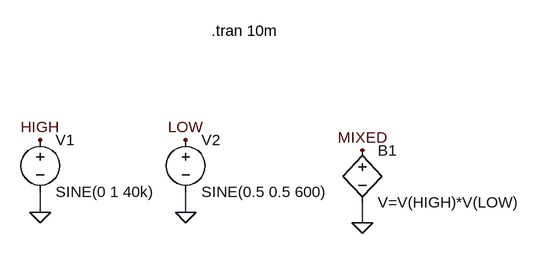
[diagram p0: schematic Draft4.asc]
Draft4.asc, the LTspice schematic file:
Version 4
SHEET 1 880 680
WIRE 0 368 0 336
WIRE 224 368 224 336
WIRE 496 384 496 352
FLAG 0 368 0
FLAG 224 368 0
FLAG 0 256 HIGH
FLAG 224 256 LOW
FLAG 496 384 0
FLAG 496 272 MIXED
SYMBOL voltage 0 240 R0
SYMATTR InstName V1
SYMATTR Value SINE(0 1 40k)
SYMBOL voltage 224 240 R0
SYMATTR InstName V2
SYMATTR Value SINE(0.5 0.5 600)
SYMBOL bv 496 256 R0
SYMATTR InstName B1
SYMATTR Value V=V(HIGH)*V(LOW)
TEXT 264 88 Left 2 !.tran 10m

The netlist it stands for:
* Draft4.asc
V1 HIGH 0 SINE(0 1 40k)
V2 LOW 0 SINE(0.5 0.5 600)
B1 MIXED 0 V=V(HIGH)*V(LOW)
.tran 10m
.backanno
.end